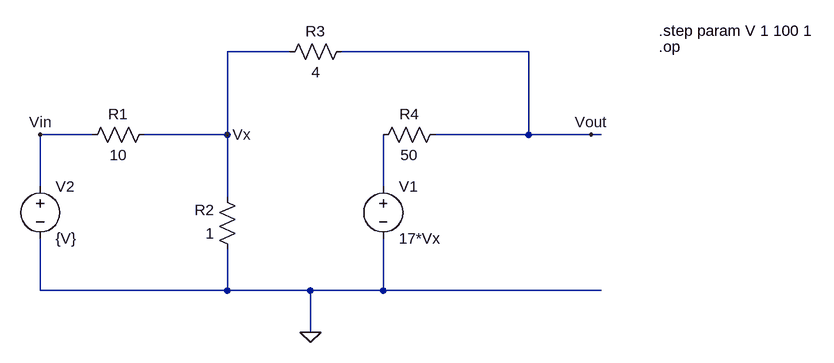
[diagram p0: schematic MuE_Set_2.asc]
MuE_Set_2.asc, the LTspice schematic file:
Version 4
SHEET 1 880 680
WIRE -96 -32 -192 -32
WIRE 272 -32 -16 -32
WIRE -400 96 -480 96
WIRE -192 96 -192 -32
WIRE -192 96 -320 96
WIRE 272 96 272 -32
WIRE 272 96 128 96
WIRE 368 96 272 96
WIRE 384 96 368 96
WIRE -480 176 -480 96
WIRE 48 176 48 96
WIRE -192 192 -192 96
WIRE -480 336 -480 256
WIRE -192 336 -192 272
WIRE -192 336 -480 336
WIRE -64 336 -192 336
WIRE 48 336 48 256
WIRE 48 336 -64 336
WIRE 384 336 48 336
WIRE -64 400 -64 336
FLAG -64 400 0
FLAG 368 96 Vout
FLAG -192 96 Vx
FLAG -480 96 Vin
SYMBOL voltage 48 160 R0
WINDOW 123 0 0 Left 0
WINDOW 39 0 0 Left 0
SYMATTR InstName V1
SYMATTR Value 17*Vx
SYMBOL voltage -480 160 R0
WINDOW 123 0 0 Left 0
WINDOW 39 0 0 Left 0
SYMATTR InstName V2
SYMATTR Value {V}
SYMBOL res -304 80 R90
WINDOW 0 0 56 VBottom 2
WINDOW 3 32 56 VTop 2
SYMATTR InstName R1
SYMATTR Value 10
SYMBOL res -176 288 R180
WINDOW 0 36 76 Left 2
WINDOW 3 36 40 Left 2
SYMATTR InstName R2
SYMATTR Value 1
SYMBOL res -112 -16 R270
WINDOW 0 32 56 VTop 2
WINDOW 3 0 56 VBottom 2
SYMATTR InstName R3
SYMATTR Value 4
SYMBOL res 32 112 R270
WINDOW 0 32 56 VTop 2
WINDOW 3 0 56 VBottom 2
SYMATTR InstName R4
SYMATTR Value 50
TEXT 472 -40 Left 2 !.op
TEXT 472 -64 Left 2 !.step param V 1 100 1

The netlist it stands for:
* MuE_Set_2.asc
V1 N001 0 17*Vx
V2 Vin 0 {V}
R1 Vx Vin 10
R2 0 Vx 1
R3 Vx Vout 4
R4 N001 Vout 50
.op
.step param V 1 100 1
.backanno
.end